# EAGLE schematic SBPB_FM_v2.3 (EAGLE 8.6.2)
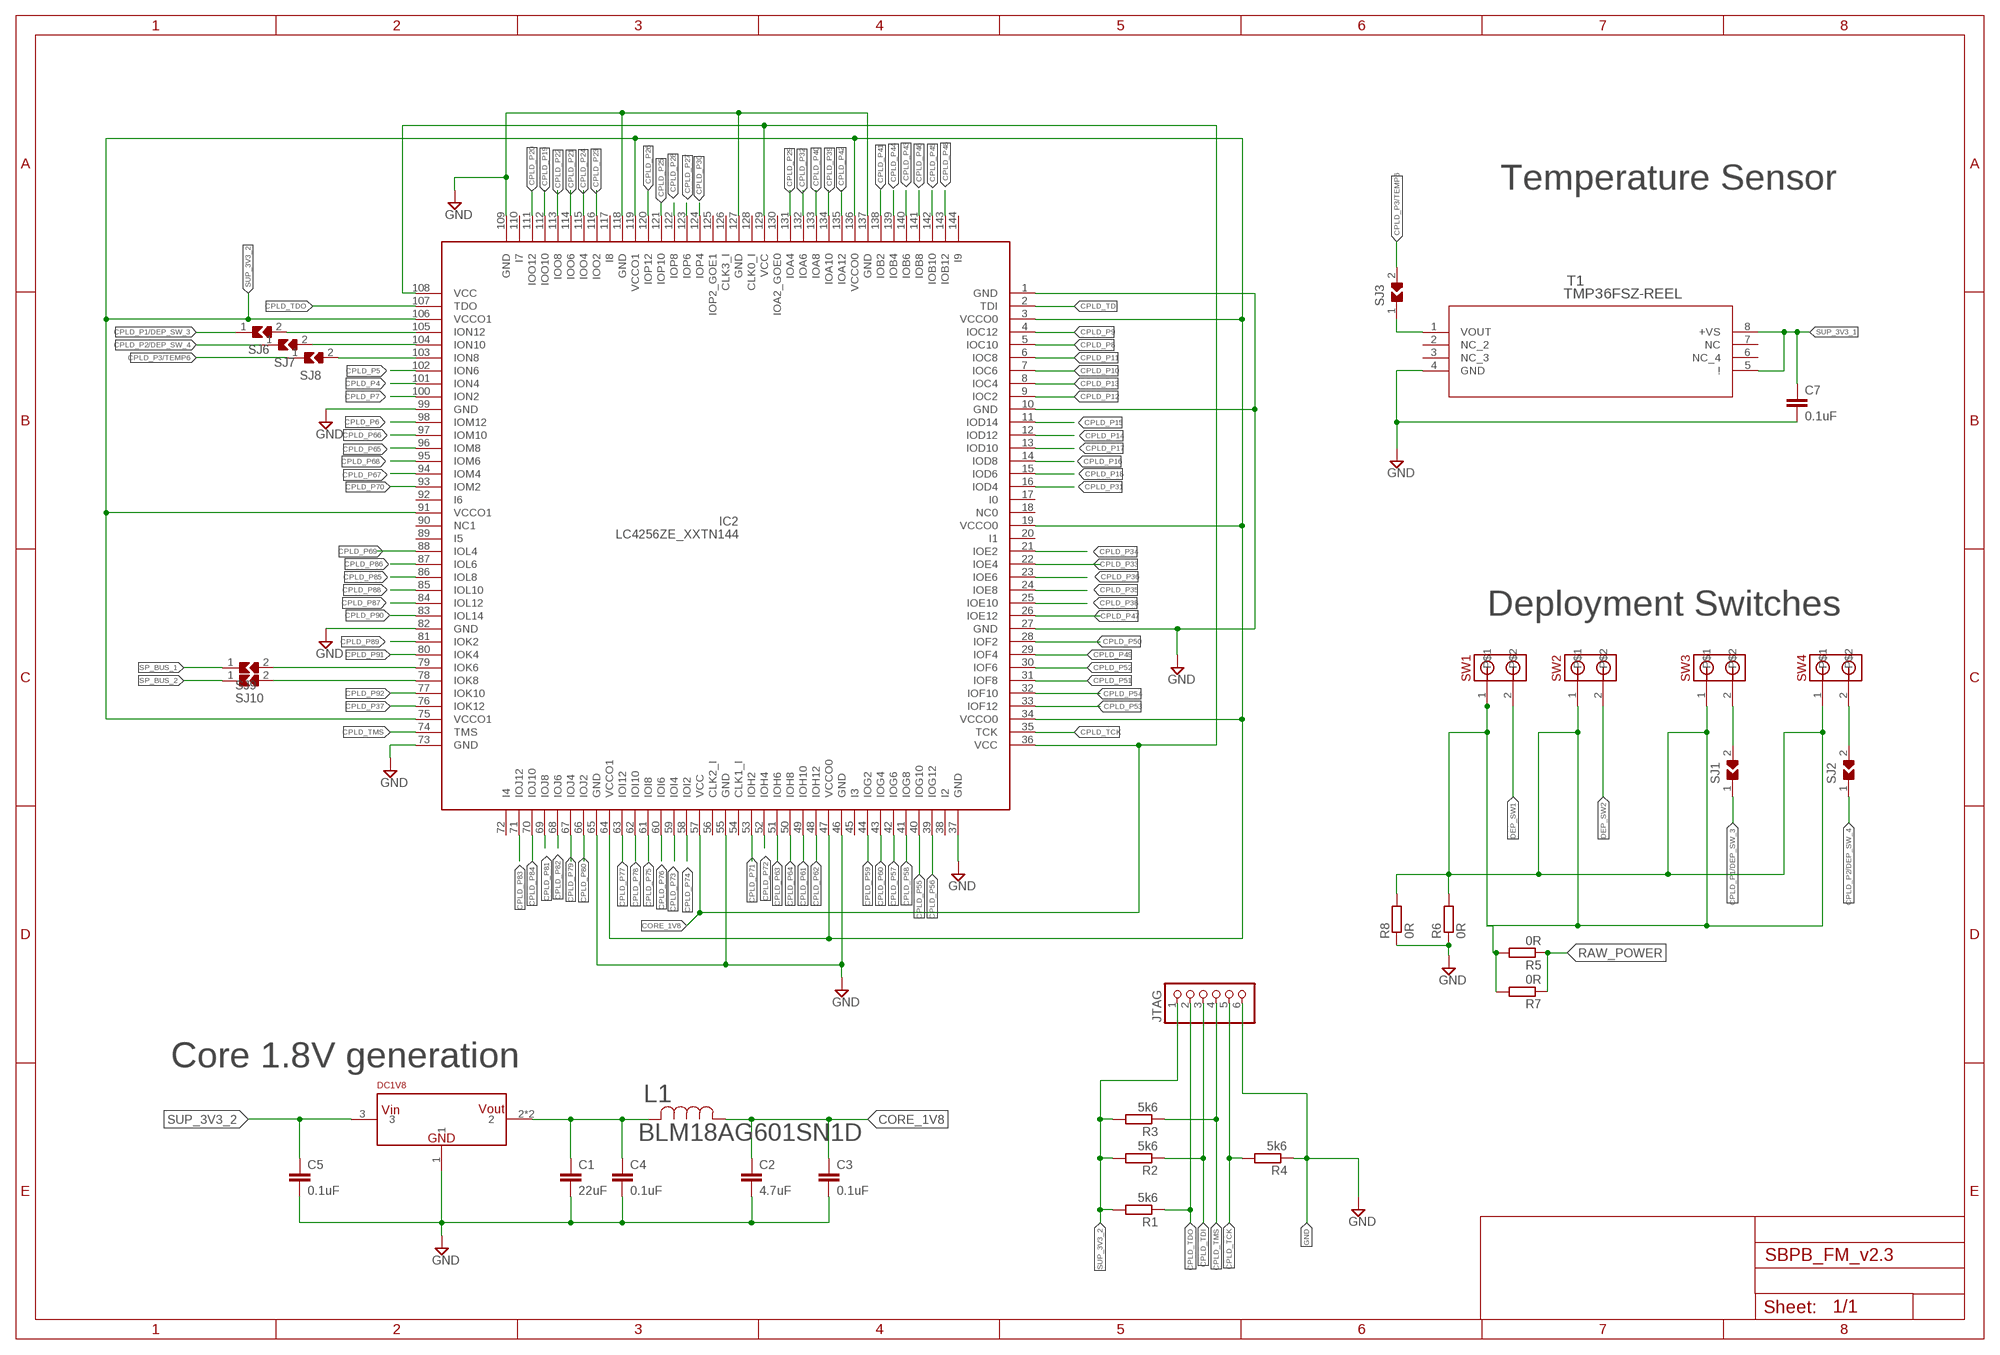
[diagram p0: schematic, sheet 1, part 1 of 2]
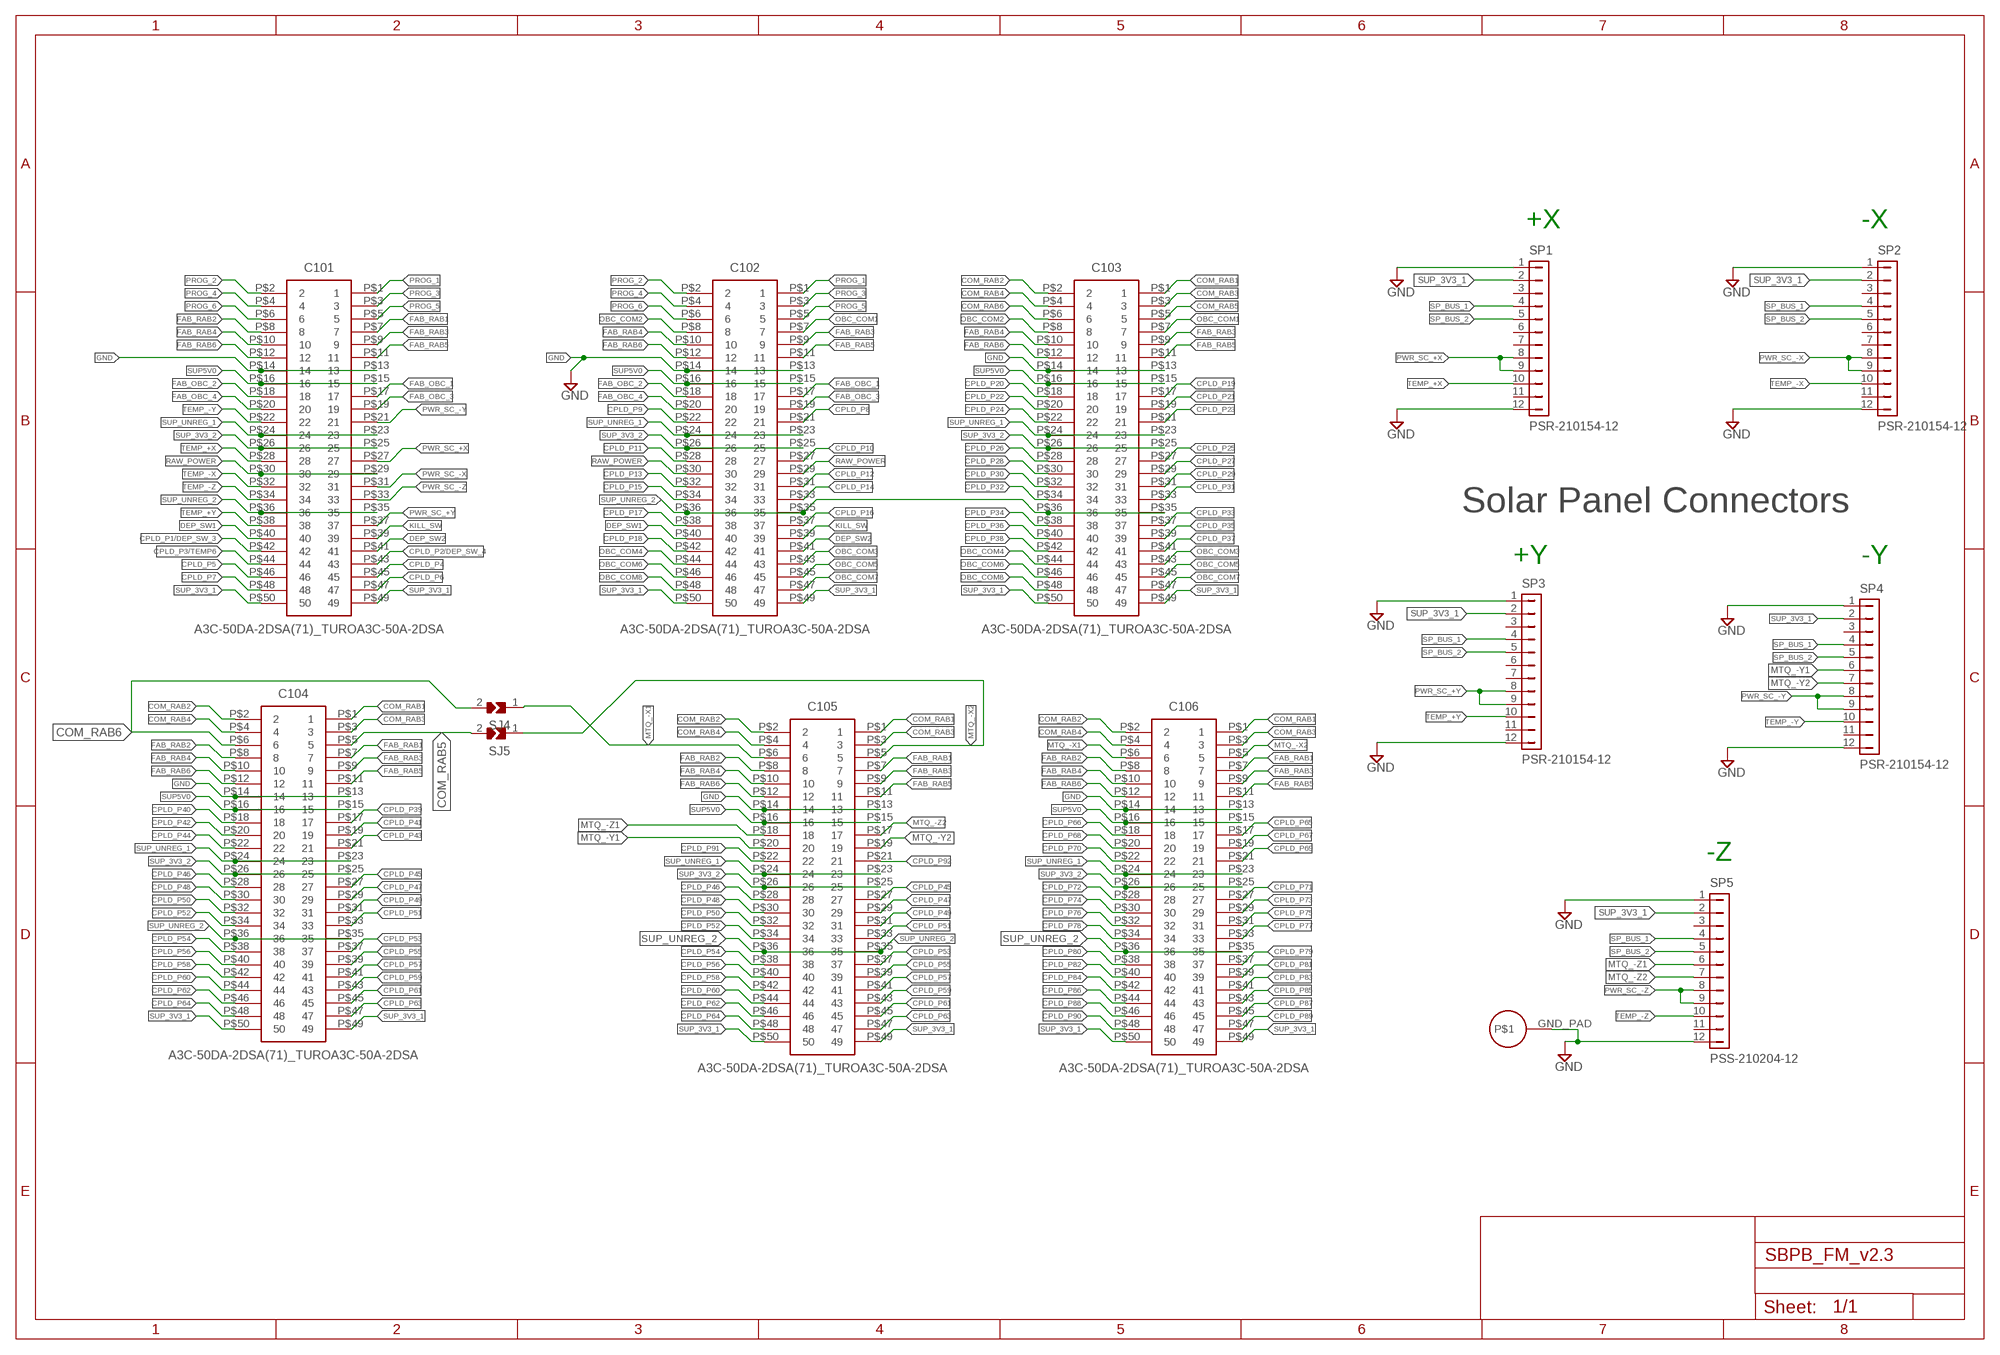
[diagram p1: schematic, sheet 1, part 2 of 2]

## Parts
C1  22uF  CC2012  [C2012]
C2  4.7uF  CC2012  [C2012]
C3  0.1uF  CC0402  [C0402]
C4  0.1uF  CC0402  [C0402]
C5  0.1uF  CC0402  [C0402]
C7  0.1uF  CC0402  [C0402]
C101  A3C-50DA-2DSA(71)_TUROA3C-50A-2DSA  [SHDR50W60P200_2X25_5000X400X44_TR]
C102  A3C-50DA-2DSA(71)_TUROA3C-50A-2DSA  [SHDR50W60P200_2X25_5000X400X44_TR]
C103  A3C-50DA-2DSA(71)_TUROA3C-50A-2DSA  [SHDR50W60P200_2X25_5000X400X44_TR]
C104  A3C-50DA-2DSA(71)_TUROA3C-50A-2DSA  [SHDR50W60P200_2X25_5000X400X44_TR]
C105  A3C-50DA-2DSA(71)_TUROA3C-50A-2DSA  [SHDR50W60P200_2X25_5000X400X44_TR]
C106  A3C-50DA-2DSA(71)_TUROA3C-50A-2DSA  [SHDR50W60P200_2X25_5000X400X44_TR]
DC1V8  NCV1117ST18T3G  [SOT223]
IC2  LC4256ZE_XXTN144  [TQFP144]
JTAG  PINHD-1X6  [1X06]
L1  BLM18AG601SN1D  [IND_BLM18_0603]
R1  5k6  RR0402  [R0402]
R2  5k6  RR0402  [R0402]
R3  5k6  RR0402  [R0402]
R4  5k6  RR0402  [R0402]
R5  0R  RR3216  [R3216]
R6  0R  RR3216  [R3216]
R7  0R  RR3216  [R3216]
R8  0R  RR3216  [R3216]
SJ1  SJ_BY_TURO  [SJ_TURO]
SJ2  0R  SJ_BY_TURO  [SJ_TURO]
SJ3  SJ_BY_TURO  [SJ_TURO]
SJ4  SJ_BY_TURO  [SJ_TURO]
SJ5  SJ_BY_TURO  [SJ_TURO]
SJ6  SJ_BY_TURO  [SJ_TURO]
SJ7  SJ_BY_TURO  [SJ_TURO]
SJ8  SJ_BY_TURO  [SJ_TURO]
SJ9  SJ_BY_TURO  [SJ_TURO]
SJ10  SJ_BY_TURO  [SJ_TURO]
SP1  PSR-210154-12  [PIN1X12/90]
SP2  PSR-210154-12  [PIN1X12/90]
SP3  PSR-210154-12  [PIN1X12/90]
SP4  PSR-210154-12  [PIN1X12/90]
SP5  PSS-210204-12  [PIN1X12]
SW1  MOLEX-CONN-2-0554600272  [MOLEX-CONN-2-BIRDS]
SW2  MOLEX-CONN-2-0554600272  [MOLEX-CONN-2-BIRDS]
SW3  MOLEX-CONN-2-0554600272  [MOLEX-CONN-2-BIRDS]
SW4  MOLEX-CONN-2-0554600272  [MOLEX-CONN-2-BIRDS]
T1  TMP36FSZ-REEL  [R_8]
U$1  GND_PAD  [GND_PAD]

## Nets
COM_RAB1: C103.P$1 C104.P$1 C105.P$1 C106.P$1
COM_RAB2: C103.P$2 C104.P$2 C105.P$2 C106.P$2
COM_RAB3: C103.P$3 C104.P$3 C105.P$3 C106.P$3
COM_RAB4: C103.P$4 C104.P$4 C105.P$4 C106.P$4
COM_RAB5: C103.P$5 C104.P$5 SJ5.2
COM_RAB6: C103.P$6 C104.P$6 SJ4.2
CORE_1V8: C2.1 C3.1 IC2.36(VCC) IC2.57(VCC) IC2.108(VCC) IC2.129(VCC) L1.1
CPLD_P1/DEP_SW_3: C101.P$42 SJ1.1 SJ6.1
CPLD_P2/DEP_SW_4: C101.P$43 SJ2.1 SJ7.1
CPLD_P3/TEMP6: C101.P$44 SJ3.2 SJ8.1
CPLD_P4: C101.P$45 IC2.101(ION4)
CPLD_P5: C101.P$46 IC2.102(ION6)
CPLD_P6: C101.P$47 IC2.98(IOM12)
CPLD_P7: C101.P$48 IC2.100(ION2)
CPLD_P8: C102.P$21 IC2.5(IOC10)
CPLD_P9: C102.P$22 IC2.4(IOC12)
CPLD_P10: C102.P$27 IC2.7(IOC6)
CPLD_P11: C102.P$28 IC2.6(IOC8)
CPLD_P12: C102.P$31 IC2.9(IOC2)
CPLD_P13: C102.P$32 IC2.8(IOC4)
CPLD_P14: C102.P$33 IC2.12(IOD12)
CPLD_P15: C102.P$34 IC2.11(IOD14)
CPLD_P16: C102.P$37 IC2.14(IOD8)
CPLD_P17: C102.P$38 IC2.13(IOD10)
CPLD_P18: C102.P$42 IC2.15(IOD6)
CPLD_P19: C103.P$17 IC2.112(IOO10)
CPLD_P20: C103.P$18 IC2.111(IOO12)
CPLD_P21: C103.P$19 IC2.114(IOO6)
CPLD_P22: C103.P$20 IC2.113(IOO8)
CPLD_P23: C103.P$21 IC2.116(IOO2)
CPLD_P24 [POWER]: C103.P$22 IC2.115(IOO4)
CPLD_P25: C103.P$27 IC2.121(IOP10)
CPLD_P26: C103.P$28 IC2.120(IOP12)
CPLD_P27: C103.P$29 IC2.123(IOP6)
CPLD_P28: C103.P$30 IC2.122(IOP8)
CPLD_P29: C103.P$31 IC2.131(IOA4)
CPLD_P30: C103.P$32 IC2.124(IOP4)
CPLD_P31: C103.P$33 IC2.16(IOD4)
CPLD_P32: C103.P$34 IC2.132(IOA6)
CPLD_P33: C103.P$37 IC2.22(IOE4)
CPLD_P34: C103.P$38 IC2.21(IOE2)
CPLD_P35: C103.P$39 IC2.24(IOE8)
CPLD_P36: C103.P$40 IC2.23(IOE6)
CPLD_P37: C103.P$41 IC2.76(IOK12)
CPLD_P38: C103.P$42 IC2.25(IOE10)
CPLD_P39: C104.P$17 IC2.134(IOA10)
CPLD_P40: C104.P$18 IC2.133(IOA8)
CPLD_P41: C104.P$19 IC2.138(IOB2)
CPLD_P42: C104.P$20 IC2.135(IOA12)
CPLD_P43: C104.P$21 IC2.140(IOB6)
CPLD_P44 [POWER]: C104.P$22 IC2.139(IOB4)
CPLD_P45: C104.P$27 C105.P$27 IC2.142(IOB10)
CPLD_P46: C104.P$28 C105.P$28 IC2.141(IOB8)
CPLD_P47: C104.P$29 C105.P$29 IC2.26(IOE12)
CPLD_P48: C104.P$30 C105.P$30 IC2.143(IOB12)
CPLD_P49: C104.P$31 C105.P$31 IC2.29(IOF4)
CPLD_P50: C104.P$32 C105.P$32 IC2.28(IOF2)
CPLD_P51: C104.P$33 C105.P$33 IC2.31(IOF8)
CPLD_P52: C104.P$34 C105.P$34 IC2.30(IOF6)
CPLD_P53: C104.P$37 C105.P$37 IC2.33(IOF12)
CPLD_P54: C104.P$38 C105.P$38 IC2.32(IOF10)
CPLD_P55: C104.P$39 C105.P$39 IC2.40(IOG10)
CPLD_P56: C104.P$40 C105.P$40 IC2.39(IOG12)
CPLD_P57: C104.P$41 C105.P$41 IC2.42(IOG6)
CPLD_P58: C104.P$42 C105.P$42 IC2.41(IOG8)
CPLD_P59: C104.P$43 C105.P$43 IC2.44(IOG2)
CPLD_P60: C104.P$44 C105.P$44 IC2.43(IOG4)
CPLD_P61: C104.P$45 C105.P$45 IC2.49(IOH10)
CPLD_P62: C104.P$46 C105.P$46 IC2.48(IOH12)
CPLD_P63: C104.P$47 C105.P$47 IC2.51(IOH6)
CPLD_P64: C104.P$48 C105.P$48 IC2.50(IOH8)
CPLD_P65: C106.P$17 IC2.96(IOM8)
CPLD_P66: C106.P$18 IC2.97(IOM10)
CPLD_P67: C106.P$19 IC2.94(IOM4)
CPLD_P68: C106.P$20 IC2.95(IOM6)
CPLD_P69: C106.P$21 IC2.88(IOL4)
CPLD_P70 [POWER]: C106.P$22 IC2.93(IOM2)
CPLD_P71: C106.P$27 IC2.53(IOH2)
CPLD_P72: C106.P$28 IC2.52(IOH4)
CPLD_P73: C106.P$29 IC2.59(IOI4)
CPLD_P74: C106.P$30 IC2.58(IOI2)
CPLD_P75: C106.P$31 IC2.61(IOI8)
CPLD_P76: C106.P$32 IC2.60(IOI6)
CPLD_P77: C106.P$33 IC2.63(IOI12)
CPLD_P78: C106.P$34 IC2.62(IOI10)
CPLD_P79: C106.P$37 IC2.67(IOJ4)
CPLD_P80: C106.P$38 IC2.66(IOJ2)
CPLD_P81: C106.P$39 IC2.69(IOJ8)
CPLD_P82: C106.P$40 IC2.68(IOJ6)
CPLD_P83: C106.P$41 IC2.71(IOJ12)
CPLD_P84: C106.P$42 IC2.70(IOJ10)
CPLD_P85: C106.P$43 IC2.86(IOL8)
CPLD_P86: C106.P$44 IC2.87(IOL6)
CPLD_P87: C106.P$45 IC2.84(IOL12)
CPLD_P88: C106.P$46 IC2.85(IOL10)
CPLD_P89: C106.P$47 IC2.81(IOK2)
CPLD_P90: C106.P$48 IC2.83(IOL14)
CPLD_P91: C105.P$22 IC2.80(IOK4)
CPLD_P92: C105.P$21 IC2.77(IOK10)
CPLD_TCK: IC2.35(TCK) JTAG.5 R4.2
CPLD_TDI: IC2.2(TDI) JTAG.3 R2.1
CPLD_TDO: IC2.107(TDO) JTAG.2 R1.1
CPLD_TMS: IC2.74(TMS) JTAG.4 R3.1
DEP_SW1: C101.P$40 C102.P$40 SW1.2
DEP_SW2: C101.P$41 C102.P$41 SW2.2
DEP_SW_POWER: R5.2 R6.2 R7.2 R8.2 SW1.1 SW2.1 SW3.1 SW4.1
FAB_OBC_1: C101.P$17 C102.P$17
FAB_OBC_2: C101.P$18 C102.P$18
FAB_OBC_3: C101.P$19 C102.P$19
FAB_OBC_4: C101.P$20 C102.P$20
FAB_RAB1: C101.P$7 C104.P$7 C105.P$7 C106.P$7
FAB_RAB2: C101.P$8 C104.P$8 C105.P$8 C106.P$8
FAB_RAB3: C101.P$9 C102.P$9 C103.P$9 C104.P$9 C105.P$9 C106.P$9
FAB_RAB4: C101.P$10 C102.P$10 C103.P$10 C104.P$10 C105.P$10 C106.P$10
FAB_RAB5: C101.P$11 C102.P$11 C103.P$11 C104.P$11 C105.P$11 C106.P$11
FAB_RAB6: C101.P$12 C102.P$12 C103.P$12 C104.P$12 C105.P$12 C106.P$12
GND [GND]: C1.2 C2.2 C3.2 C4.2 C5.2 C7.2 C101.P$13 C101.P$14 C102.P$13 C102.P$14 C103.P$13 C103.P$14 C104.P$13 C104.P$14 C105.P$13 C105.P$14 C106.P$13 C106.P$14 DC1V8.1 IC2.1(GND) IC2.10(GND) IC2.27(GND) IC2.37(GND) IC2.46(GND) IC2.55(GND) IC2.65(GND) IC2.73(GND) IC2.82(GND) IC2.99(GND) IC2.109(GND) IC2.118(GND) IC2.127(GND) IC2.137(GND) JTAG.6 R4.1 R6.1 R8.1 SP1.1 SP1.12 SP2.1 SP2.12 SP3.1 SP3.12 SP4.1 SP4.12 SP5.1 SP5.12 T1.4(GND) U$1.GND_PAD
KILL_SW: C101.P$39 C102.P$39
MTQ_-X1: C105.P$6 C106.P$6 SJ4.1
MTQ_-X2: C105.P$5 C106.P$5 SJ5.1
MTQ_-Y1: C105.P$20 SP4.6
MTQ_-Y2: C105.P$19 SP4.7
MTQ_-Z1: C105.P$18 SP5.6
MTQ_-Z2: C105.P$17 SP5.7
N$5: C1.1 C4.1 DC1V8.2 DC1V8.4 L1.2
N$8: SJ2.2 SW4.2
N$9: SJ1.2 SW3.2
N$13: SJ3.1 T1.1(VOUT)
N$14: IC2.105(ION12) SJ6.2
N$15: IC2.104(ION10) SJ7.2
N$16: IC2.103(ION8) SJ8.2
N$23: IC2.79(IOK6) SJ9.2
N$24: IC2.78(IOK8) SJ10.2
OBC_COM1: C102.P$7 C103.P$7
OBC_COM2: C102.P$8 C103.P$8
OBC_COM3: C102.P$43 C103.P$43
OBC_COM4: C102.P$44 C103.P$44
OBC_COM5: C102.P$45 C103.P$45
OBC_COM6: C102.P$46 C103.P$46
OBC_COM7: C102.P$47 C103.P$47
OBC_COM8: C102.P$48 C103.P$48
PROG_1: C101.P$1 C102.P$1
PROG_2: C101.P$2 C102.P$2
PROG_3: C101.P$3 C102.P$3
PROG_4: C101.P$4 C102.P$4
PROG_5: C101.P$5 C102.P$5
PROG_6: C101.P$6 C102.P$6
PWR_SC_+X [POWER]: C101.P$27 SP1.8 SP1.9
PWR_SC_+Y [POWER]: C101.P$37 SP3.8 SP3.9
PWR_SC_-X [POWER]: C101.P$31 SP2.8 SP2.9
PWR_SC_-Y [POWER]: C101.P$21 SP4.8 SP4.9
PWR_SC_-Z [POWER]: C101.P$33 SP5.8 SP5.9
RAW_POWER: C101.P$29 C101.P$30 C102.P$29 C102.P$30 R5.1 R7.1
SP_BUS_1: SJ9.1 SP1.4 SP2.4 SP3.4 SP4.4 SP5.4
SP_BUS_2: SJ10.1 SP1.5 SP2.5 SP3.5 SP4.5 SP5.5
SUP5V0 [POWER]: C101.P$15 C101.P$16 C102.P$15 C102.P$16 C103.P$15 C103.P$16 C104.P$15 C104.P$16 C105.P$15 C105.P$16 C106.P$15 C106.P$16
SUP_3V3_1 [POWER]: C7.1 C101.P$49 C101.P$50 C102.P$49 C102.P$50 C103.P$49 C103.P$50 C104.P$49 C104.P$50 C105.P$49 C105.P$50 C106.P$49 C106.P$50 SP1.2 SP2.2 SP3.2 SP4.2 SP5.2 T1.5(!) T1.8(+VS)
SUP_3V3_2 [POWER]: C5.1 C101.P$25 C101.P$26 C102.P$25 C102.P$26 C103.P$25 C103.P$26 C104.P$25 C104.P$26 C105.P$25 C105.P$26 C106.P$25 C106.P$26 DC1V8.3 IC2.3(VCCO0) IC2.19(VCCO0) IC2.34(VCCO0) IC2.47(VCCO0) IC2.64(VCCO1) IC2.75(VCCO1) IC2.91(VCCO1) IC2.106(VCCO1) IC2.119(VCCO1) IC2.136(VCCO0) JTAG.1 R1.2 R2.2 R3.2
SUP_UNREG_1 [POWER]: C101.P$23 C101.P$24 C102.P$23 C102.P$24 C103.P$23 C103.P$24 C104.P$23 C104.P$24 C105.P$23 C105.P$24 C106.P$23 C106.P$24
SUP_UNREG_2 [POWER]: C101.P$35 C101.P$36 C102.P$35 C102.P$36 C103.P$35 C103.P$36 C104.P$35 C104.P$36 C105.P$35 C105.P$36 C106.P$35 C106.P$36
TEMP_+X: C101.P$28 SP1.10
TEMP_+Y: C101.P$38 SP3.10
TEMP_-X: C101.P$32 SP2.10
TEMP_-Y: C101.P$22 SP4.10
TEMP_-Z: C101.P$34 SP5.10
Unconnected: IC2.17(I0) IC2.18(NC0) IC2.20(I1) IC2.38(I2) IC2.45(I3) IC2.54(CLK1_I) IC2.56(CLK2_I) IC2.72(I4) IC2.89(I5) IC2.90(NC1) IC2.92(I6) IC2.110(I7) IC2.117(I8) IC2.125(IOP2_GOE1) IC2.126(CLK3_I) IC2.128(CLK0_I) IC2.130(IOA2_GOE0) IC2.144(I9) SP1.3 SP1.6 SP1.7 SP1.11 SP2.3 SP2.6 SP2.7 SP2.11 SP3.3 SP3.6 SP3.7 SP3.11 SP4.3 SP4.11 SP5.3 SP5.11 T1.2(NC_2) T1.3(NC_3) T1.6(NC_4) T1.7(NC)

## Notes on the sheet
- Temperature Sensor
- +X | -X
- Solar Panel Connectors
- +Y | -Y
- Deployment Switches
- -Z
- Core 1.8V generation

## Library data of the parts
C1-C5 C7 = Turo_collection:C: CAPACITOR, European symbol; SPICEMODEL: NONE; SPICEPREFIX: C
C101-C106 = Turo_collection:A3C-50DA-2DSA(71)_TURO: Hirose A3C Series 2mm 50 Way 2 Row Straight PCB Socket Through Hole Board to Wire <http://uk.rs-online.com/largeimages/R7793068-01.jpg> Source: Datasheet <https://www.google.co.uk/url?sa=t&rct=j&q=&esrc=s&source=web&cd=5&ved=0ahUKEwiW7Ov7l8PWAhUDCsAKHbxmCjsQFgg9MAQ&url=https://www.hirose.com/product/en/download_file/key_name/A3/category/Catalog/doc_file_id/49521/?file_category_id>
DC1V8 = Turo_collection:NCV1117ST18T3G: Linear Voltage Regulator IC Positive Fixed 1 Output 1.8V 1A SOT-223 https://www.digikey.com/product-detail/en/on-semiconductor/NCV1117ST18T3G/NCV1117ST18T3GOSCT-ND/3487436
IC2 = Turo_collection:LC4256ZE_XXTN144: ispMACH 4256ZE TQFP144 Lattice Semiconductor Corporation - ispMACH 4000ZE Ultra Low Power, Low Cost CPLD Family Generated using Lattice BSDL models: http://www.latticesemi.com/dynamic/index.cfm?fuseaction=view_documents&document_type=36&sloc=01-01-02-01&source=sidebar
JTAG = Turo_collection:PINHD-1X6: PIN HEADER
L1 = Turo_collection:BLM18AG601SN1D: BLM18AG601SN1D FERRITE BEAD 600 OHM 0603 1LN Murata Electronics North America Datasheet: https://www.murata.com/en-us/products/productdata/8796738650142/ENFA0003.pdf; MANUFACTURER_PART_NUMBER: BLM18AG601SN1D; VENDOR: MURATA
R1-R8 = Turo_collection:R: RESISTOR, European symbol; SPICEMODEL: NONE; SPICEPREFIX: R
SJ1-SJ10 = Turo_collection:SJ_BY_TURO
SP1-SP4 = Turo_collection:PSR-210154-12
SP5 = Turo_collection:PSS-210204-12: Used for -Z panel on the backplane Created by Turo - 2018
SW1-SW4 = Turo_collection:MOLEX-CONN-2-0554600272
T1 = Turo_collection:TMP36FSZ-REEL; MANUFACTURER_PART_NUMBER: TMP36FSZREEL; VENDOR: Analog Devices Inc
U$1 = Turo_collection:GND_PAD

## Net classes
1 GND: width 0.2 mm, clearance 0.127 mm
2 POWER: width 0.2 mm, clearance 0.02 mm